# EAGLE schematic h_bridge (EAGLE 7.2.0)
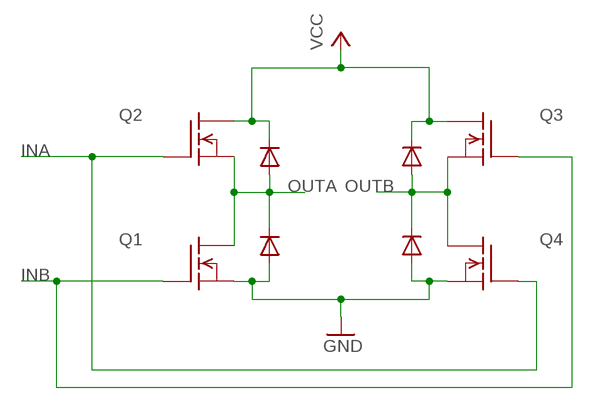
[diagram p0: schematic, sheet 1]

## Parts
Q1  BSS97  [TO202]
Q2  BSS97  [TO202]
Q3  BSS97  [TO202]
Q4  BSS97  [TO202]

## Nets
GND: Q1.1(S) Q4.1(S)
INA: Q2.3(G) Q4.3(G)
INB: Q1.3(G) Q3.3(G)
OUTA: Q1.2(D) Q2.1(S)
OUTB: Q3.1(S) Q4.2(D)
VCC: Q2.2(D) Q3.2(D)

## Library data of the parts
Q1-Q4 = transistor-fet:BSS97: N-Channel Enhancement MOSFET 200V; 1.5A; 1,6Ohm